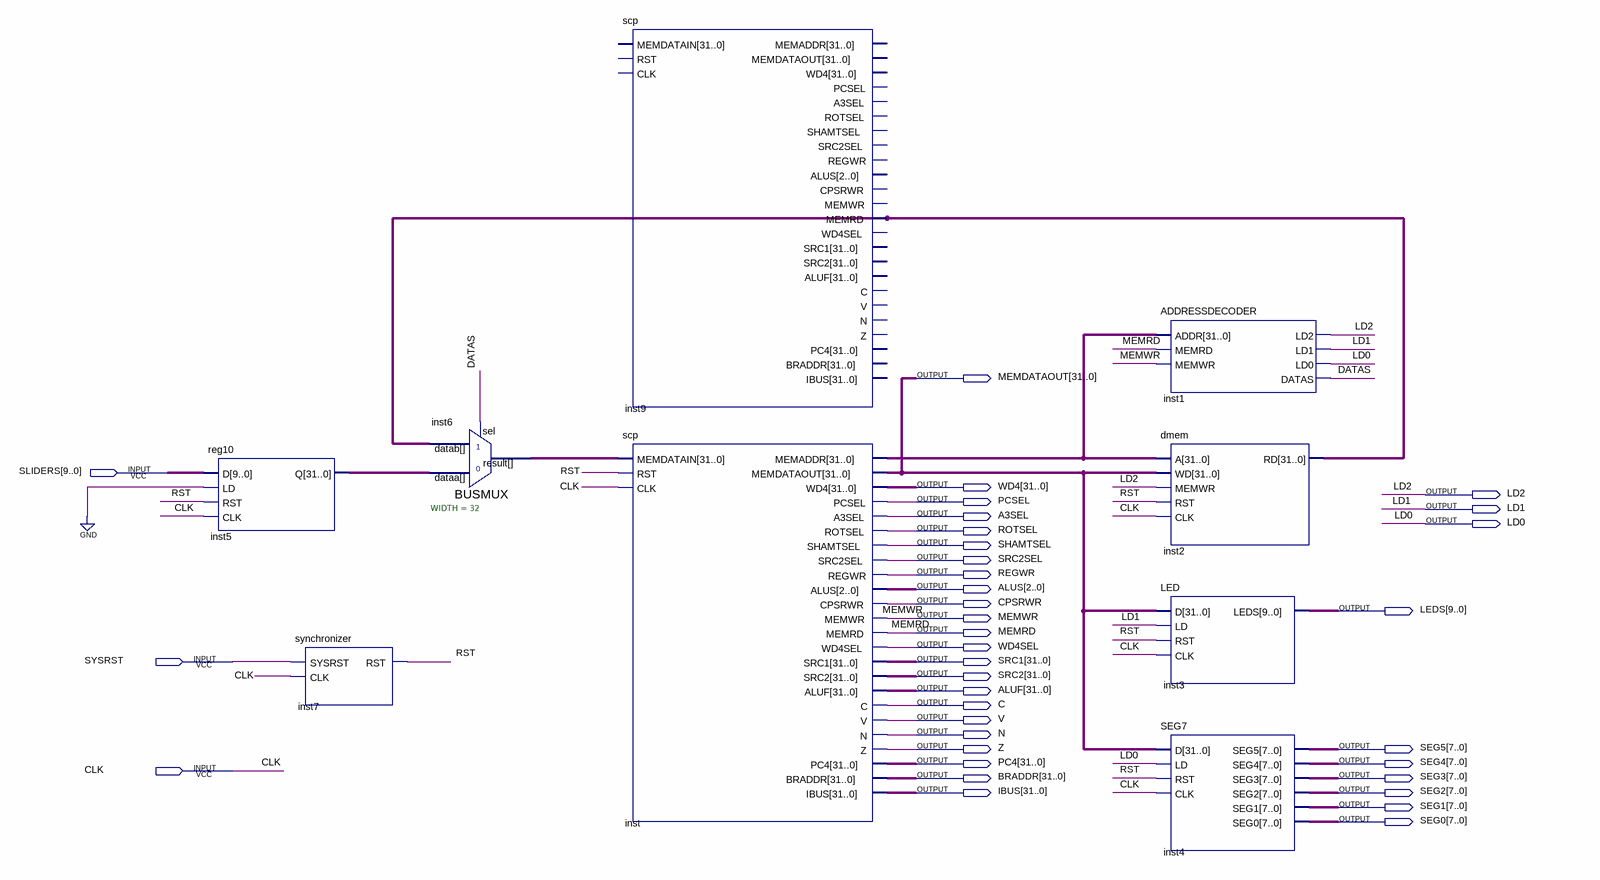
[diagram p0: schematic sheet]
// Quartus schematic system.bdf as structural Verilog: 9 symbols, 36 pins
module system (
  input  [9:0] SLIDERS,
  input  SYSRST,
  input  CLK,
  output [31:0] MEMDATAOUT,
  output [31:0] WD4,
  output LD2,
  output PCSEL,
  output LD1,
  output A3SEL,
  output LD0,
  output ROTSEL,
  output SHAMTSEL,
  output SRC2SEL,
  output REGWR,
  output [2:0] ALUS,
  output CPSRWR,
  output [9:0] LEDS,
  output MEMWR,
  output MEMRD,
  output WD4SEL,
  output [31:0] SRC1,
  output [31:0] SRC2,
  output [31:0] ALUF,
  output C,
  output V,
  output N,
  output Z,
  output [7:0] SEG5,
  output [31:0] PC4,
  output [7:0] SEG4,
  output [31:0] BRADDR,
  output [7:0] SEG3,
  output [31:0] IBUS,
  output [7:0] SEG2,
  output [7:0] SEG1,
  output [7:0] SEG0
);

  wire DATAS, RST;
  wire [31:0] inst5_q, inst6_result, inst9_memrd, inst_memaddr;

  reg10 inst5 (.D(SLIDERS), .LD(1'b0), .RST(RST), .CLK(CLK), .Q(inst5_q));
  synchronizer inst7 (.SYSRST(SYSRST), .CLK(CLK), .RST(RST));
  BUSMUX #(.WIDTH(32)) inst6 (.datab(inst9_memrd), .sel(DATAS), .dataa(inst5_q), .result(inst6_result));
  scp inst9 (.MEMRD(inst9_memrd));  // open: MEMDATAIN, RST, CLK, MEMADDR, MEMDATAOUT, WD4, PCSEL, A3SEL, ROTSEL, SHAMTSEL, SRC2SEL, REGWR, ALUS, CPSRWR, MEMWR, WD4SEL, SRC1, SRC2, ALUF, C, V, N, Z, PC4, BRADDR, IBUS
  scp inst (
    .MEMDATAIN(inst6_result), .RST(RST), .CLK(CLK), .MEMADDR(inst_memaddr), .MEMDATAOUT(MEMDATAOUT),
    .WD4(WD4), .PCSEL(PCSEL), .A3SEL(A3SEL), .ROTSEL(ROTSEL), .SHAMTSEL(SHAMTSEL), .SRC2SEL(SRC2SEL),
    .REGWR(REGWR), .ALUS(ALUS), .CPSRWR(CPSRWR), .MEMWR(MEMWR), .MEMRD(MEMRD), .WD4SEL(WD4SEL), .SRC1(SRC1),
    .SRC2(SRC2), .ALUF(ALUF), .C(C), .V(V), .N(N), .Z(Z), .PC4(PC4), .BRADDR(BRADDR), .IBUS(IBUS));
  ADDRESSDECODER inst1 (
    .ADDR(inst_memaddr), .MEMRD(MEMRD), .MEMWR(MEMWR), .LD2(LD2), .LD1(LD1), .LD0(LD0), .DATAS(DATAS));
  dmem inst2 (.A(inst_memaddr), .WD(MEMDATAOUT), .MEMWR(LD2), .RST(RST), .CLK(CLK), .RD(inst9_memrd));
  LED inst3 (.D(MEMDATAOUT), .LD(LD1), .RST(RST), .CLK(CLK), .LEDS(LEDS));
  SEG7 inst4 (
    .D(MEMDATAOUT), .LD(LD0), .RST(RST), .CLK(CLK), .SEG5(SEG5), .SEG4(SEG4), .SEG3(SEG3), .SEG2(SEG2),
    .SEG1(SEG1), .SEG0(SEG0));
endmodule
